# Altium project 14.8V-5V-Buck_test.PrjPcb
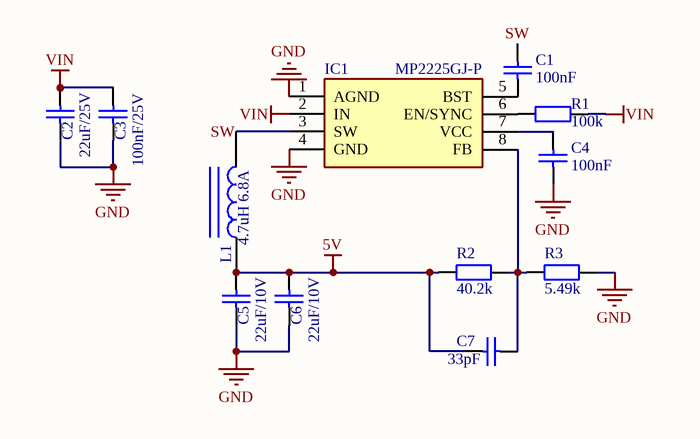
[diagram p0: 14.8V-5V-Buck_test.SchDoc]
1 sheet, 12 parts. Net scope: global (net labels, ports and power ports of the same name join across sheets).
Board file: 14.8V-5V-Buck_test.PcbDoc

## Sheet 14.8V-5V-Buck_test.SchDoc
size 292 x 193 mm; Author: Power Lin; DocumentNumber: 1; SheetNumber: 1; SheetTotal: 1; Website: wiki-power.com

### Parts
C1  100nF  [CAP-0603]
C2  22uF/25V  [CAP-0603]
C3  100nF/25V  [CAP-0603]
C4  100nF  [CAP-0603]
C5  22uF/10V  [CAP-0603]
C6  22uF/10V  [CAP-0603]
C7  33pF  [CAP-0603]
IC1  MP2225GJ-P  [TSOT-23-8]
L1  4.7uH 6.8A  [XAL6060-103MEB]
R1  100k  [R-0603]
R2  40.2k  [R-0603]
R3  5.49k  [R-0603]

### Nets
5V: C5.2 C6.2 C7.2 L1.1 R2.2
GND: C2.1 C3.1 C4.1 C5.1 C6.1 IC1.1(AGND) IC1.4(GND) R3.1
VIN: C2.2 C3.2 IC1.2(IN) R1.1
SW: C1.1 IC1.3(SW) L1.2
NetC1_2: C1.2 IC1.5(BST)
NetC4_2: C4.2 IC1.7(VCC)
NetC7_1: C7.1 IC1.8(FB) R2.1 R3.2
NetIC1_6: IC1.6(EN/SYNC) R1.2

### Notes on the sheet
- Author
- DocumentName
- ModifiedDate
- ProjectName
- SheetNumber
- SheetTotal
- Website
- Revision

### Library data of the parts
C1-C7 = CAP: 贴片电容; ComponentLink1Description: 供应商链接; ComponentLink1URL: http://www.szlcsc.com/product/details_53938.html; Package: 0402; Supplier: LC; SuppliersPartNumber: C52923
IC1 = MP2225GJ-P: 稳压芯片; Manufacturer_Name: Monolithic Power Systems (MPS); Description: Switching Voltage Regulators HighEfficiency5A 18V Sync Step Down Conv; Datasheet Link: https://altium.componentsearchengine.com/Datasheets/1/MP2225GJ-P.pdf; Height: 1mm; Manufacturer_Part_Number: MP2225GJ-P; Mouser Part Number: 946-MP2225GJ-P; Mouser Price/Stock: https://www.mouser.co.uk/ProductDetail/Monolithic-Power-Systems-MPS/MP2225GJ-P?qs=CjgjetG5vV6PhweCipdhAQ%3D%3D
L1 = INDUCTOR: 电感; ComponentLink1Description: 供应商链接; ComponentLink1URL: http://www.szlcsc.com/product/details_33003.html; Package: 0402; Supplier: LC; SuppliersPartNumber: C32041
R1-R3 = RES: 贴片电阻; Package: 0805; Supplier: LC; SuppliersPartNumber: C17798